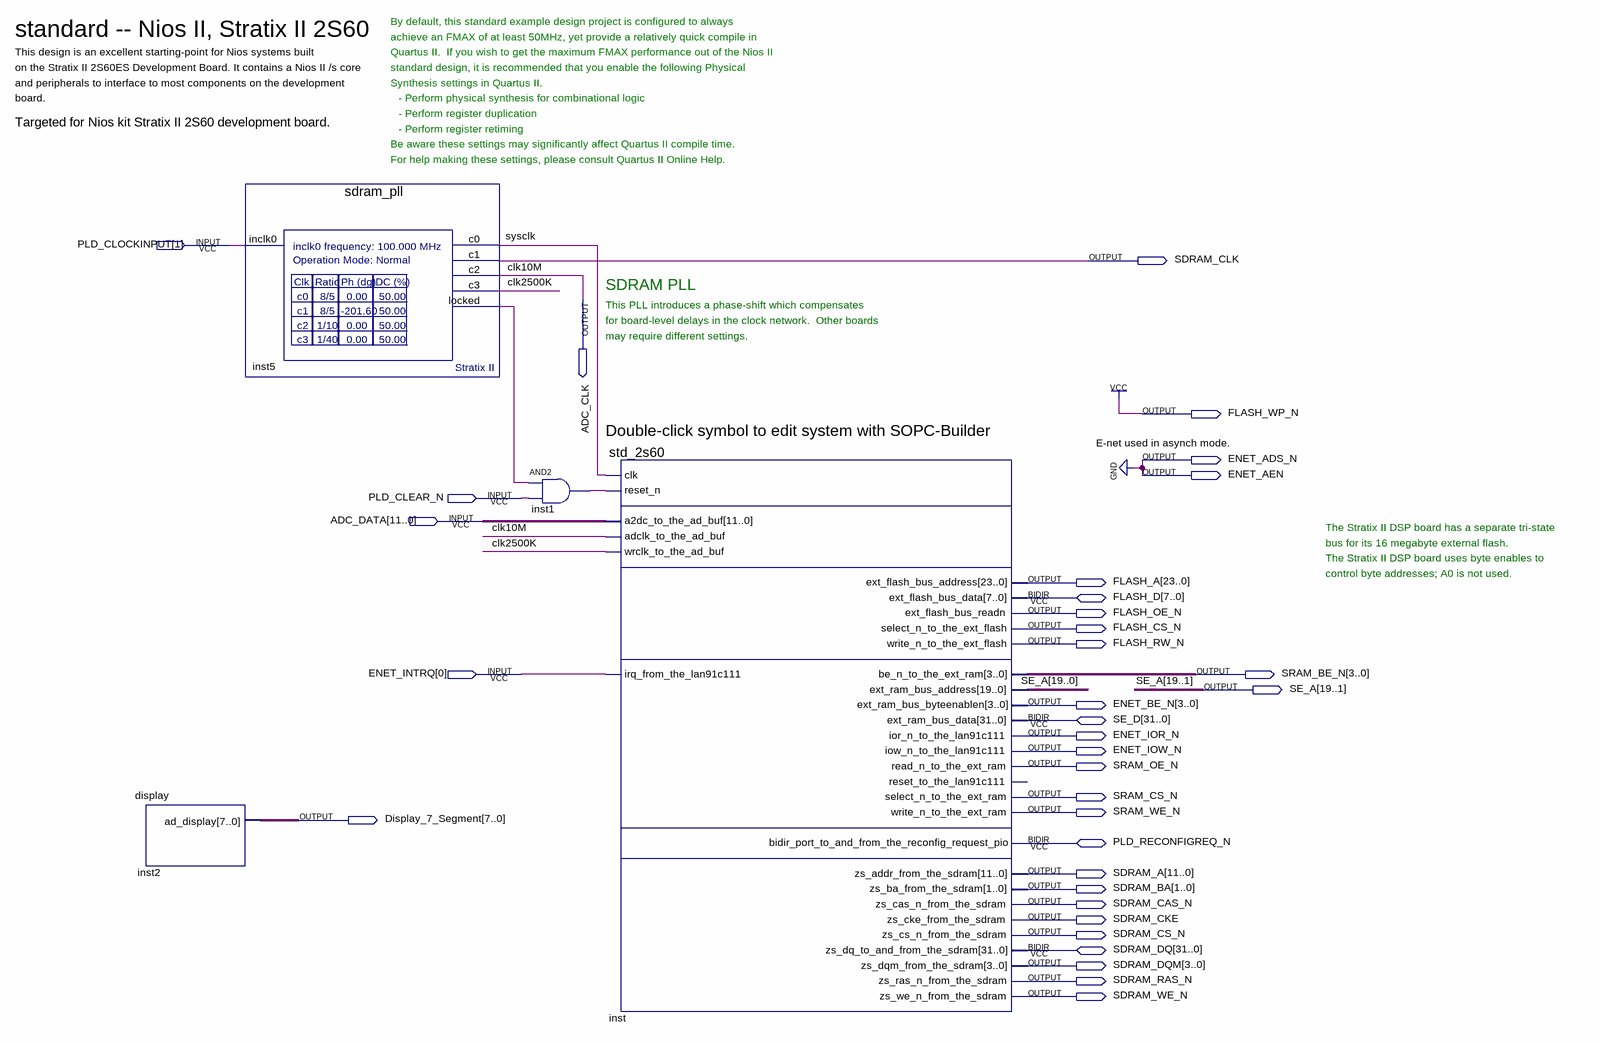
[diagram p0: schematic sheet]
// Quartus schematic standard.bdf as structural Verilog: 4 symbols, 34 pins
module standard (
  input  [1:1] PLD_CLOCKINPUT,
  input  PLD_CLEAR_N,
  input  [11:0] ADC_DATA,
  input  [0:0] ENET_INTRQ,
  inout  [7:0] FLASH_D,
  inout  [31:0] SE_D,
  inout  PLD_RECONFIGREQ_N,
  inout  [31:0] SDRAM_DQ,
  output SDRAM_CLK,
  output ADC_CLK,
  output FLASH_WP_N,
  output ENET_ADS_N,
  output ENET_AEN,
  output [23:0] FLASH_A,
  output FLASH_OE_N,
  output FLASH_CS_N,
  output FLASH_RW_N,
  output [3:0] SRAM_BE_N,
  output [19:0] SE_A,
  output [3:0] ENET_BE_N,
  output ENET_IOR_N,
  output ENET_IOW_N,
  output SRAM_OE_N,
  output SRAM_CS_N,
  output SRAM_WE_N,
  output [7:0] Display_7_Segment,
  output [11:0] SDRAM_A,
  output [1:0] SDRAM_BA,
  output SDRAM_CAS_N,
  output SDRAM_CKE,
  output SDRAM_CS_N,
  output [3:0] SDRAM_DQM,
  output SDRAM_RAS_N,
  output SDRAM_WE_N
);

  wire clk2500K, inst1_out, inst5_locked, sysclk;

  display inst2 (.ad_display(Display_7_Segment));
  sdram_pll inst5 (
    .inclk0(PLD_CLOCKINPUT[1]), .c0(sysclk), .c1(SDRAM_CLK), .c2(ADC_CLK), .c3(clk2500K),
    .locked(inst5_locked));
  and inst1 (inst1_out, inst5_locked, PLD_CLEAR_N);
  std_2s60 inst (
    .clk(sysclk), .reset_n(inst1_out), .a2dc_to_the_ad_buf(ADC_DATA), .adclk_to_the_ad_buf(ADC_CLK),
    .wrclk_to_the_ad_buf(clk2500K), .irq_from_the_lan91c111(ENET_INTRQ[0]), .ext_flash_bus_address(FLASH_A),
    .ext_flash_bus_readn(FLASH_OE_N), .select_n_to_the_ext_flash(FLASH_CS_N),
    .write_n_to_the_ext_flash(FLASH_RW_N), .be_n_to_the_ext_ram(SRAM_BE_N), .ext_ram_bus_address(SE_A),
    .ext_ram_bus_byteenablen(ENET_BE_N), .ior_n_to_the_lan91c111(ENET_IOR_N),
    .iow_n_to_the_lan91c111(ENET_IOW_N), .read_n_to_the_ext_ram(SRAM_OE_N),
    .select_n_to_the_ext_ram(SRAM_CS_N), .write_n_to_the_ext_ram(SRAM_WE_N),
    .zs_addr_from_the_sdram(SDRAM_A), .zs_ba_from_the_sdram(SDRAM_BA), .zs_cas_n_from_the_sdram(SDRAM_CAS_N),
    .zs_cke_from_the_sdram(SDRAM_CKE), .zs_cs_n_from_the_sdram(SDRAM_CS_N),
    .zs_dqm_from_the_sdram(SDRAM_DQM), .zs_ras_n_from_the_sdram(SDRAM_RAS_N),
    .zs_we_n_from_the_sdram(SDRAM_WE_N), .ext_flash_bus_data(FLASH_D), .ext_ram_bus_data(SE_D),
    .bidir_port_to_and_from_the_reconfig_request_pio(PLD_RECONFIGREQ_N),
    .zs_dq_to_and_from_the_sdram(SDRAM_DQ));  // open: reset_to_the_lan91c111

  assign ENET_ADS_N = 1'b0;
  assign ENET_AEN = 1'b0;
  assign FLASH_WP_N = 1'b1;

  // Other names for the same wires on the sheet: clk10M = ADC_CLK

  // Notes on the sheet:
  //   standard -- Nios II, Stratix II 2S60
  //   By default, this standard example design project is configured to always
  //   achieve an FMAX of at least 50MHz, yet provide a relatively quick compile in
  //   This design is an excellent starting-point for Nios systems built
  //   Quartus II.  If you wish to get the maximum FMAX performance out of the Nios II
  //   on the Stratix II 2S60ES Development Board. It contains a Nios II /s core
  //   standard design, it is recommended that you enable the following Physical
  //   and peripherals to interface to most components on the development
  //   Synthesis settings in Quartus II.
  //   board.
  //   - Perform physical synthesis for combinational logic
  //   - Perform register duplication
  //   Targeted for Nios kit Stratix II 2S60 development board.
  //   - Perform register retiming
  //   Be aware these settings may significantly affect Quartus II compile time.
  //   For help making these settings, please consult Quartus II Online Help.
  //   SDRAM PLL
  //   This PLL introduces a phase-shift which compensates
  //   for board-level delays in the clock network.  Other boards
  //   may require different settings.
  //   Double-click symbol to edit system with SOPC-Builder
  //   E-net used in asynch mode.
  //   The Stratix II DSP board has a separate tri-state
  //   bus for its 16 megabyte external flash.
  //   The Stratix II DSP board uses byte enables to
  //   control byte addresses; A0 is not used.
endmodule
